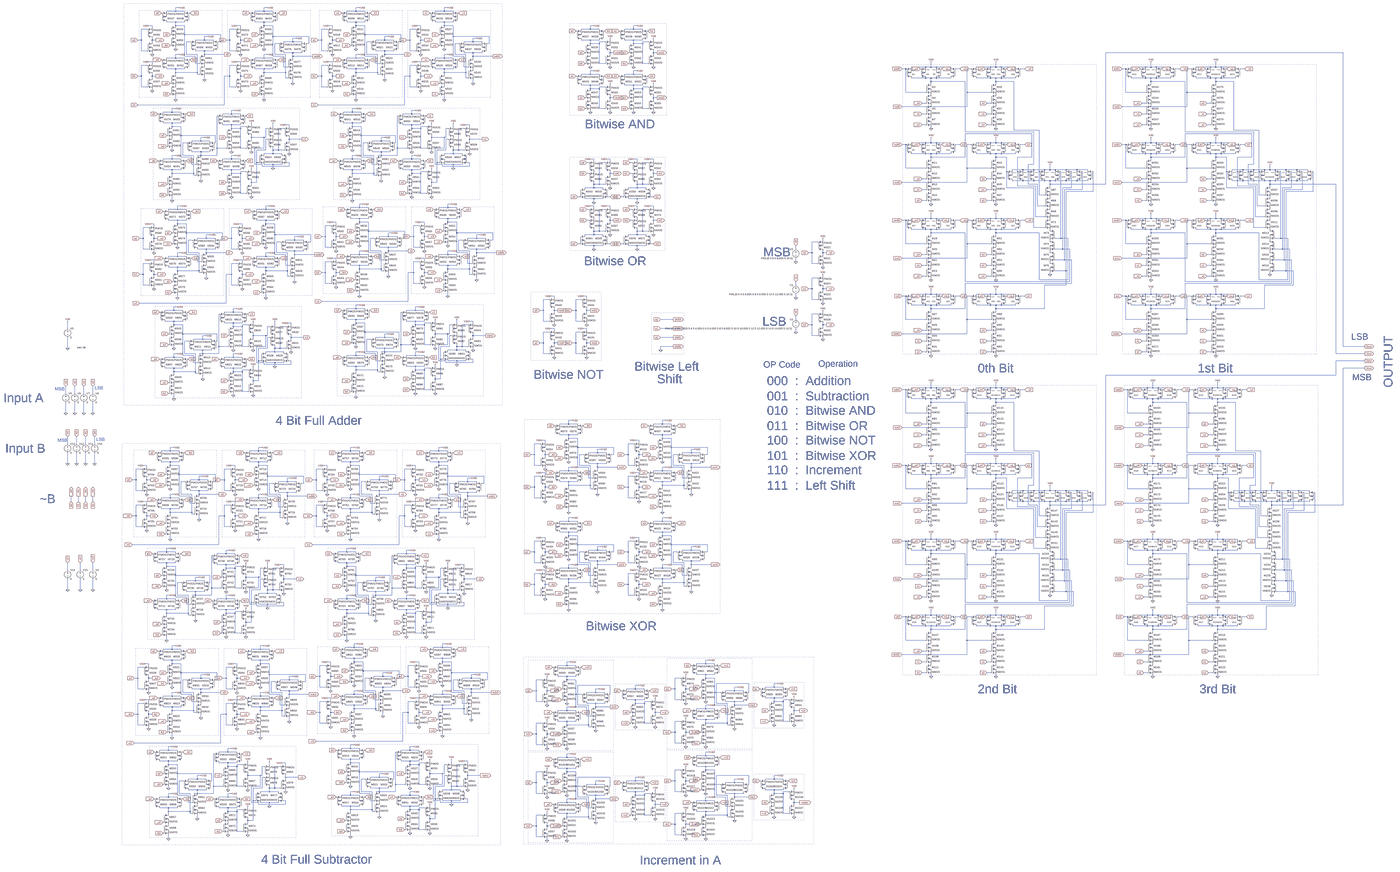
[diagram p0: schematic 4 bit ALU.asc, whole sheet]
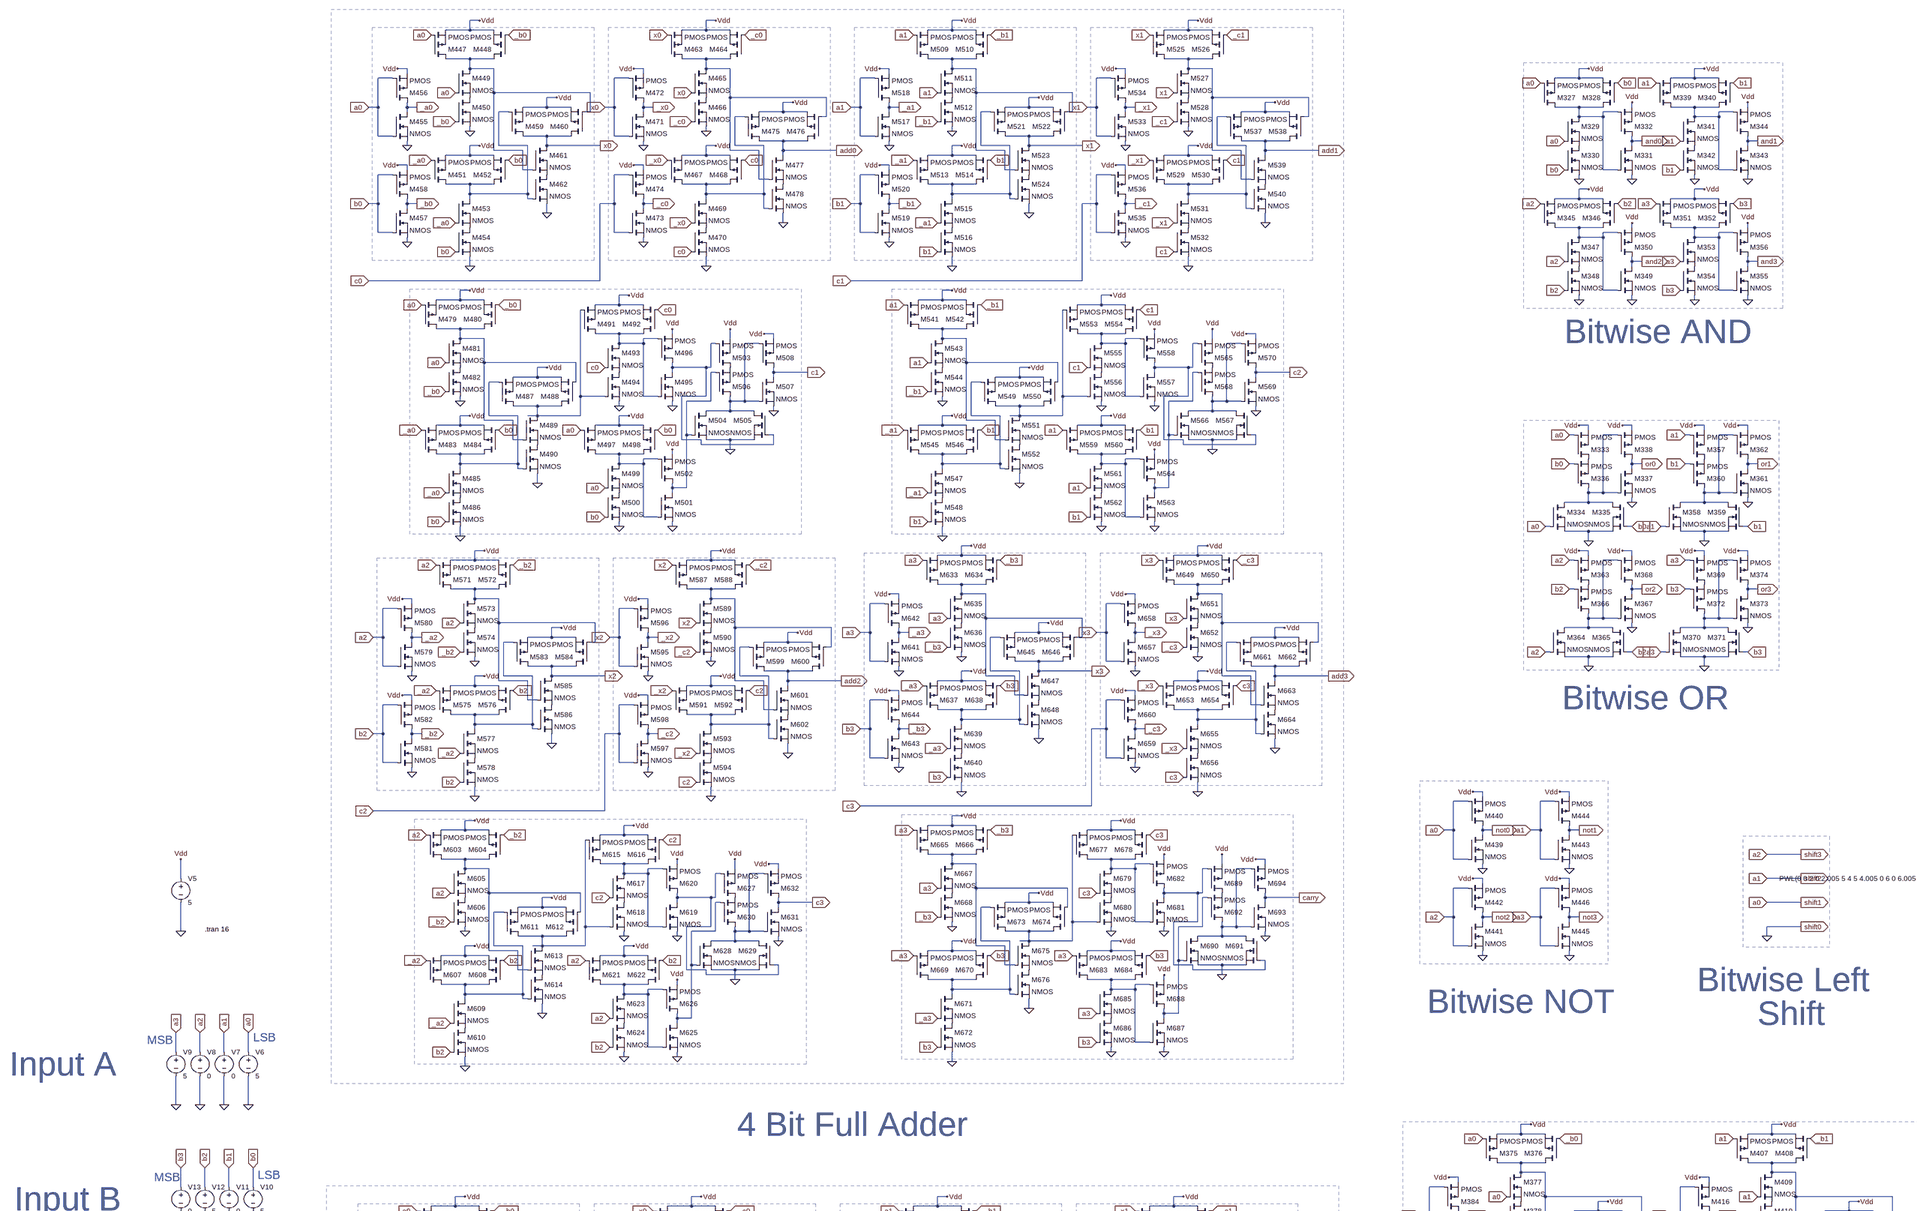
[diagram p1: schematic 4 bit ALU.asc, part, row 1 of 2, column 1 of 2]
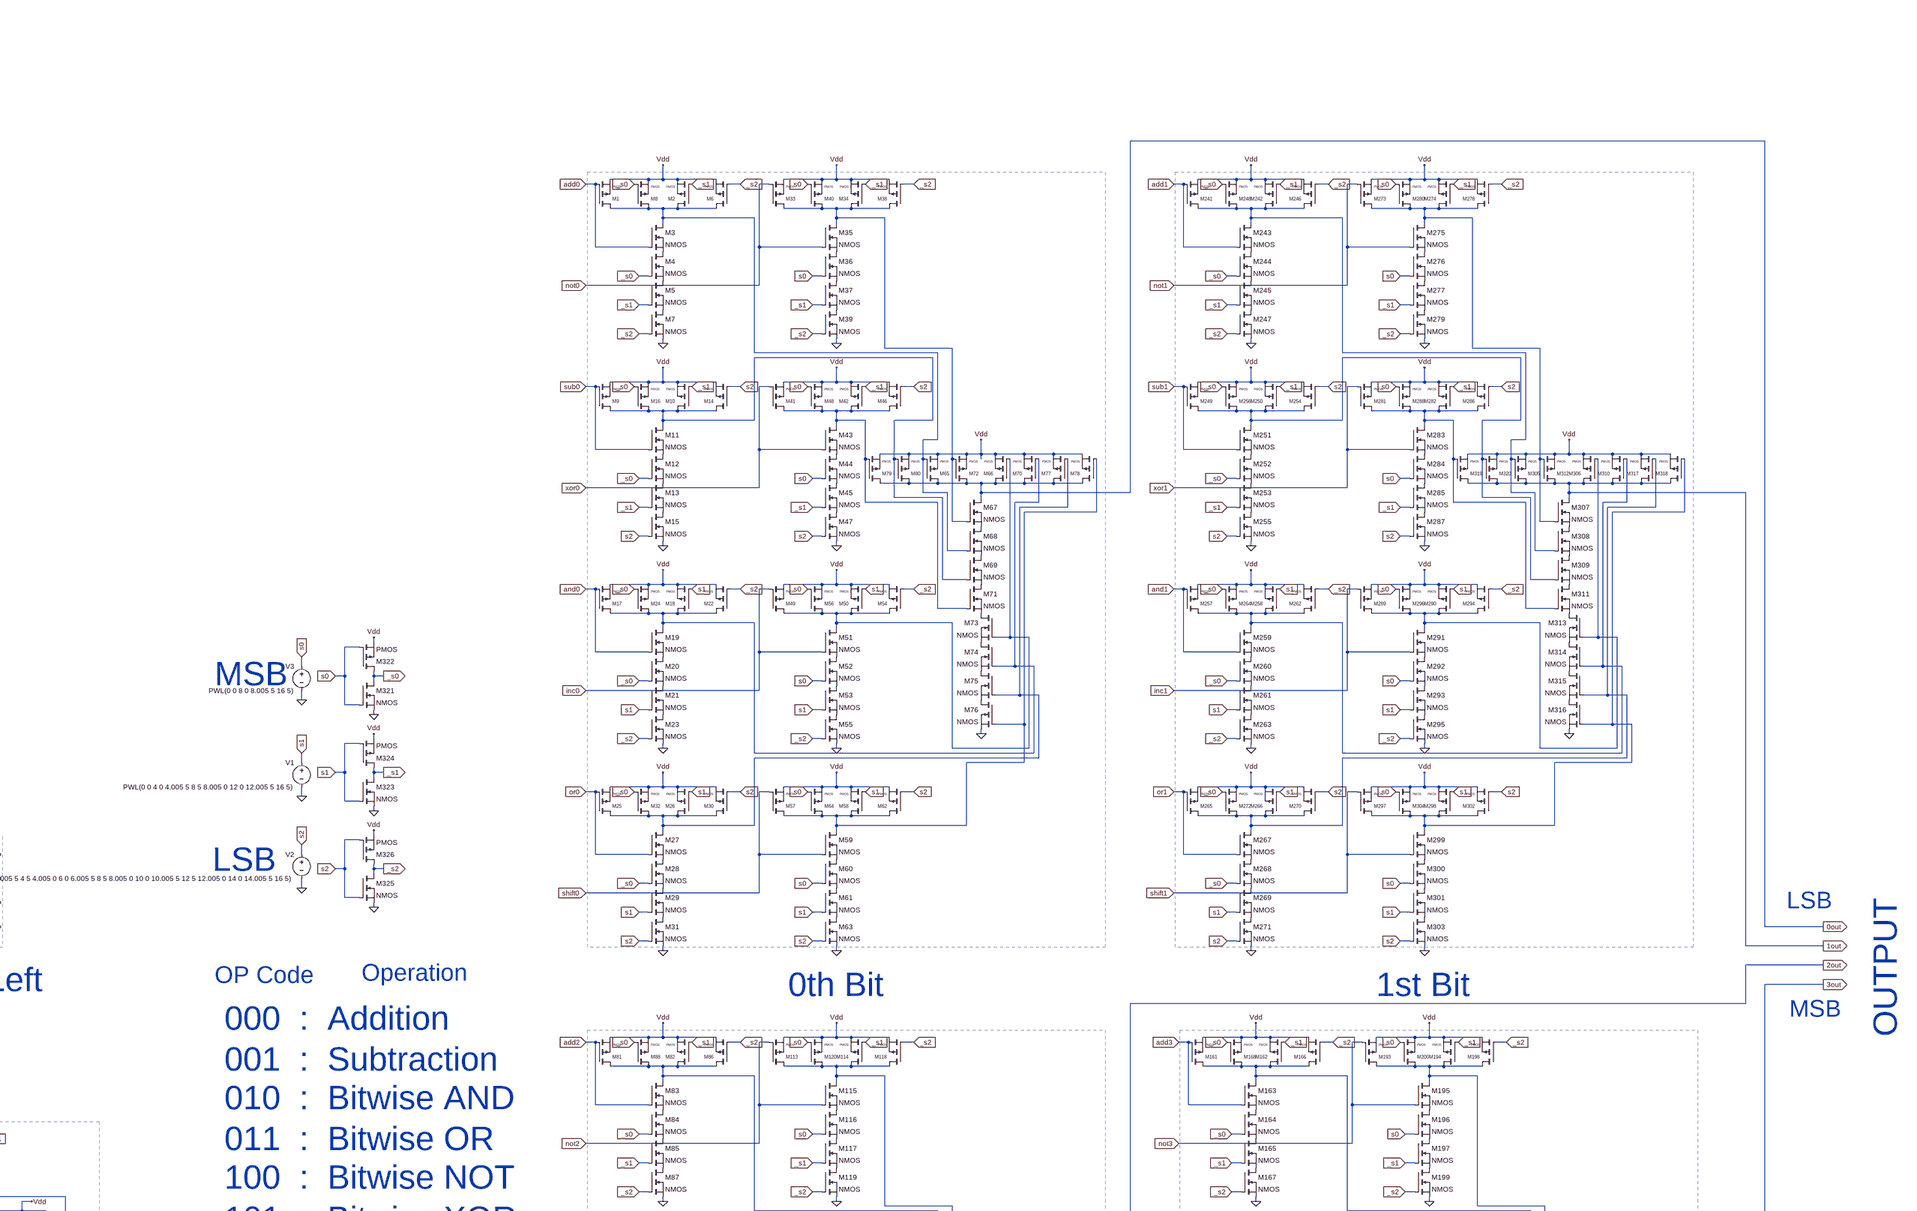
[diagram p2: schematic 4 bit ALU.asc, part, row 1 of 2, column 2 of 2]
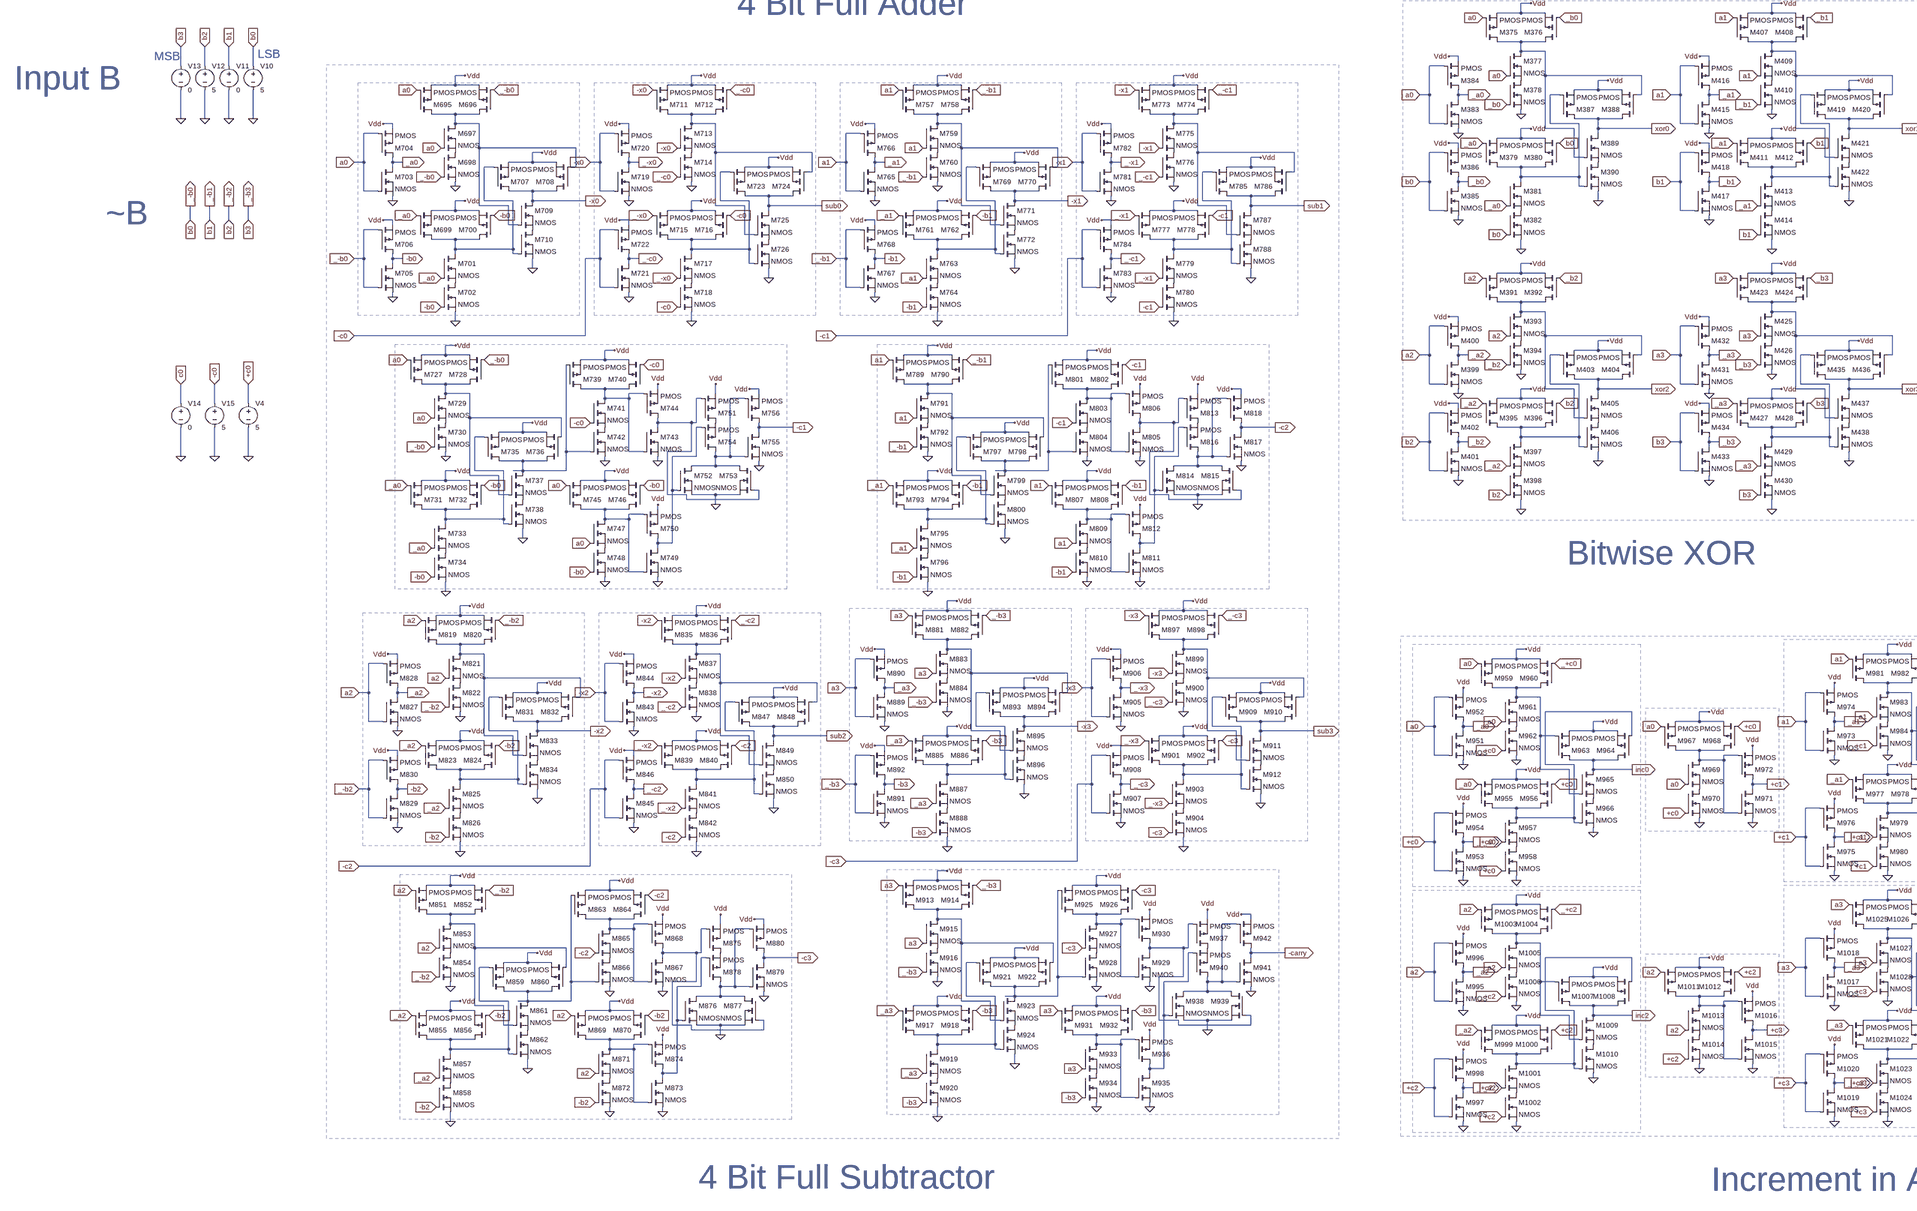
[diagram p3: schematic 4 bit ALU.asc, part, row 2 of 2, column 1 of 2]
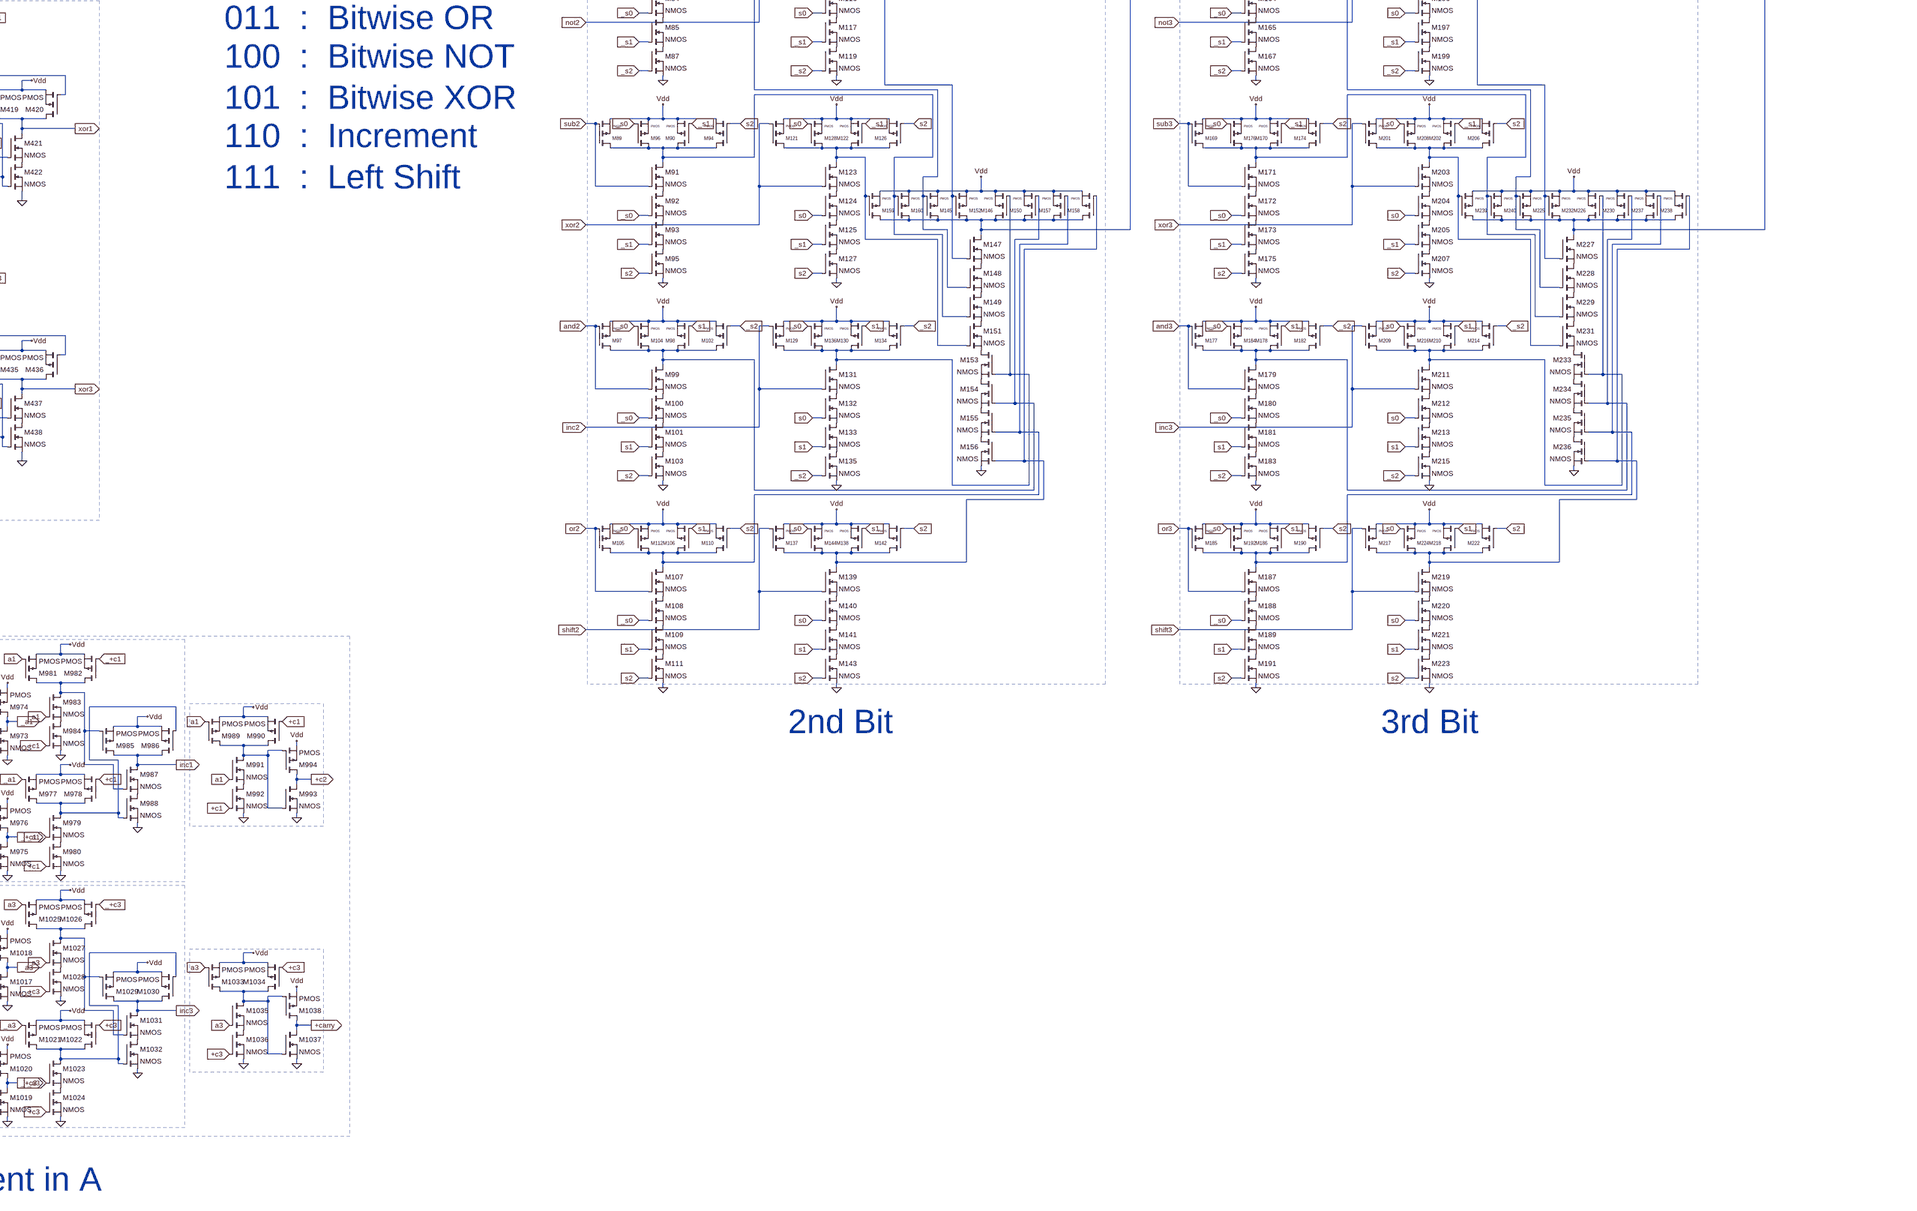
[diagram p4: schematic 4 bit ALU.asc, part, row 2 of 2, column 2 of 2]
* 4 bit ALU.asc
M1 N011 add0 Vdd Vdd PMOS
M2 N011 _s1 Vdd Vdd PMOS
M3 N011 add0 P001 P001 NMOS
M4 P001 _s0 P002 P002 NMOS
M5 P002 _s1 P003 P003 NMOS
M6 N011 _s2 Vdd Vdd PMOS
M7 P003 _s2 0 0 NMOS
M8 N011 _s0 Vdd Vdd PMOS
M9 N025 sub0 Vdd Vdd PMOS
M10 N025 _s1 Vdd Vdd PMOS
M11 N025 sub0 P004 P004 NMOS
M12 P004 _s0 P005 P005 NMOS
M13 P005 _s1 P006 P006 NMOS
M14 N025 s2 Vdd Vdd PMOS
M15 P006 s2 0 0 NMOS
M16 N025 _s0 Vdd Vdd PMOS
M17 N039 and0 Vdd Vdd PMOS
M18 N039 s1 Vdd Vdd PMOS
M19 N039 and0 P007 P007 NMOS
M20 P007 _s0 P008 P008 NMOS
M21 P008 s1 P009 P009 NMOS
M22 N039 _s2 Vdd Vdd PMOS
M23 P009 _s2 0 0 NMOS
M24 N039 _s0 Vdd Vdd PMOS
M25 N041 or0 Vdd Vdd PMOS
M26 N041 s1 Vdd Vdd PMOS
M27 N041 or0 P010 P010 NMOS
M28 P010 _s0 P011 P011 NMOS
M29 P011 s1 P012 P012 NMOS
M30 N041 s2 Vdd Vdd PMOS
M31 P012 s2 0 0 NMOS
M32 N041 _s0 Vdd Vdd PMOS
M33 N012 not0 Vdd Vdd PMOS
M34 N012 _s1 Vdd Vdd PMOS
M35 N012 not0 P013 P013 NMOS
M36 P013 s0 P014 P014 NMOS
M37 P014 _s1 P015 P015 NMOS
M38 N012 _s2 Vdd Vdd PMOS
M39 P015 _s2 0 0 NMOS
M40 N012 s0 Vdd Vdd PMOS
M41 N033 xor0 Vdd Vdd PMOS
M42 N033 _s1 Vdd Vdd PMOS
M43 N033 xor0 P016 P016 NMOS
M44 P016 s0 P017 P017 NMOS
M45 P017 _s1 P018 P018 NMOS
M46 N033 s2 Vdd Vdd PMOS
M47 P018 s2 0 0 NMOS
M48 N033 s0 Vdd Vdd PMOS
M49 N051 inc0 Vdd Vdd PMOS
M50 N051 s1 Vdd Vdd PMOS
M51 N051 inc0 P019 P019 NMOS
M52 P019 s0 P020 P020 NMOS
M53 P020 s1 P021 P021 NMOS
M54 N051 _s2 Vdd Vdd PMOS
M55 P021 _s2 0 0 NMOS
M56 N051 s0 Vdd Vdd PMOS
M57 N043 0 Vdd Vdd PMOS
M58 N043 s1 Vdd Vdd PMOS
M59 N043 0 P022 P022 NMOS
M60 P022 s0 P023 P023 NMOS
M61 P023 s1 P024 P024 NMOS
M62 N043 s2 Vdd Vdd PMOS
M63 P024 s2 0 0 NMOS
M64 N043 s0 Vdd Vdd PMOS
M65 0out N011 Vdd Vdd PMOS
M66 0out N051 Vdd Vdd PMOS
M67 0out N012 P025 P025 NMOS
M68 P025 N011 P026 P026 NMOS
M69 P026 N025 P027 P027 NMOS
M70 0out N039 Vdd Vdd PMOS
M71 P027 N033 P028 P028 NMOS
M72 0out N012 Vdd Vdd PMOS
M73 P028 N051 P029 P029 NMOS
M74 P029 N039 P030 P030 NMOS
M75 P030 N041 P031 P031 NMOS
M76 P031 N043 0 0 NMOS
M77 0out N041 Vdd Vdd PMOS
M78 0out N043 Vdd Vdd PMOS
M79 0out N033 Vdd Vdd PMOS
M80 0out N025 Vdd Vdd PMOS
M81 N073 add2 Vdd Vdd PMOS
M82 N073 _s1 Vdd Vdd PMOS
M83 N073 add2 P032 P032 NMOS
M84 P032 _s0 P033 P033 NMOS
M85 P033 _s1 P034 P034 NMOS
M86 N073 _s2 Vdd Vdd PMOS
M87 P034 _s2 0 0 NMOS
M88 N073 _s0 Vdd Vdd PMOS
M89 N081 sub2 Vdd Vdd PMOS
M90 N081 _s1 Vdd Vdd PMOS
M91 N081 sub2 P035 P035 NMOS
M92 P035 _s0 P036 P036 NMOS
M93 P036 _s1 P037 P037 NMOS
M94 N081 s2 Vdd Vdd PMOS
M95 P037 s2 0 0 NMOS
M96 N081 _s0 Vdd Vdd PMOS
M97 N093 and2 Vdd Vdd PMOS
M98 N093 s1 Vdd Vdd PMOS
M99 N093 and2 P038 P038 NMOS
M100 P038 _s0 P039 P039 NMOS
M101 P039 s1 P040 P040 NMOS
M102 N093 _s2 Vdd Vdd PMOS
M103 P040 _s2 0 0 NMOS
M104 N093 _s0 Vdd Vdd PMOS
M105 N095 or2 Vdd Vdd PMOS
M106 N095 s1 Vdd Vdd PMOS
M107 N095 or2 P041 P041 NMOS
M108 P041 _s0 P042 P042 NMOS
M109 P042 s1 P043 P043 NMOS
M110 N095 s2 Vdd Vdd PMOS
M111 P043 s2 0 0 NMOS
M112 N095 _s0 Vdd Vdd PMOS
M113 N074 not2 Vdd Vdd PMOS
M114 N074 _s1 Vdd Vdd PMOS
M115 N074 not2 P044 P044 NMOS
M116 P044 s0 P045 P045 NMOS
M117 P045 _s1 P046 P046 NMOS
M118 N074 _s2 Vdd Vdd PMOS
M119 P046 _s2 0 0 NMOS
M120 N074 s0 Vdd Vdd PMOS
M121 N087 xor2 Vdd Vdd PMOS
M122 N087 _s1 Vdd Vdd PMOS
M123 N087 xor2 P047 P047 NMOS
M124 P047 s0 P048 P048 NMOS
M125 P048 _s1 P049 P049 NMOS
M126 N087 s2 Vdd Vdd PMOS
M127 P049 s2 0 0 NMOS
M128 N087 s0 Vdd Vdd PMOS
M129 N101 inc2 Vdd Vdd PMOS
M130 N101 s1 Vdd Vdd PMOS
M131 N101 inc2 P050 P050 NMOS
M132 P050 s0 P051 P051 NMOS
M133 P051 s1 P052 P052 NMOS
M134 N101 _s2 Vdd Vdd PMOS
M135 P052 _s2 0 0 NMOS
M136 N101 s0 Vdd Vdd PMOS
M137 N097 a1 Vdd Vdd PMOS
M138 N097 s1 Vdd Vdd PMOS
M139 N097 a1 P053 P053 NMOS
M140 P053 s0 P054 P054 NMOS
M141 P054 s1 P055 P055 NMOS
M142 N097 s2 Vdd Vdd PMOS
M143 P055 s2 0 0 NMOS
M144 N097 s0 Vdd Vdd PMOS
M145 2out N073 Vdd Vdd PMOS
M146 2out N101 Vdd Vdd PMOS
M147 2out N074 P056 P056 NMOS
M148 P056 N073 P057 P057 NMOS
M149 P057 N081 P058 P058 NMOS
M150 2out N093 Vdd Vdd PMOS
M151 P058 N087 P059 P059 NMOS
M152 2out N074 Vdd Vdd PMOS
M153 P059 N101 P060 P060 NMOS
M154 P060 N093 P061 P061 NMOS
M155 P061 N095 P062 P062 NMOS
M156 P062 N097 0 0 NMOS
M157 2out N095 Vdd Vdd PMOS
M158 2out N097 Vdd Vdd PMOS
M159 2out N087 Vdd Vdd PMOS
M160 2out N081 Vdd Vdd PMOS
M161 N075 add3 Vdd Vdd PMOS
M162 N075 _s1 Vdd Vdd PMOS
M163 N075 add3 P063 P063 NMOS
M164 P063 _s0 P064 P064 NMOS
M165 P064 _s1 P065 P065 NMOS
M166 N075 _s2 Vdd Vdd PMOS
M167 P065 _s2 0 0 NMOS
M168 N075 _s0 Vdd Vdd PMOS
M169 N082 sub3 Vdd Vdd PMOS
M170 N082 _s1 Vdd Vdd PMOS
M171 N082 sub3 P066 P066 NMOS
M172 P066 _s0 P067 P067 NMOS
M173 P067 _s1 P068 P068 NMOS
M174 N082 s2 Vdd Vdd PMOS
M175 P068 s2 0 0 NMOS
M176 N082 _s0 Vdd Vdd PMOS
M177 N094 and3 Vdd Vdd PMOS
M178 N094 s1 Vdd Vdd PMOS
M179 N094 and3 P069 P069 NMOS
M180 P069 _s0 P070 P070 NMOS
M181 P070 s1 P071 P071 NMOS
M182 N094 _s2 Vdd Vdd PMOS
M183 P071 _s2 0 0 NMOS
M184 N094 _s0 Vdd Vdd PMOS
M185 N096 or3 Vdd Vdd PMOS
M186 N096 s1 Vdd Vdd PMOS
M187 N096 or3 P072 P072 NMOS
M188 P072 _s0 P073 P073 NMOS
M189 P073 s1 P074 P074 NMOS
M190 N096 s2 Vdd Vdd PMOS
M191 P074 s2 0 0 NMOS
M192 N096 _s0 Vdd Vdd PMOS
M193 N076 not3 Vdd Vdd PMOS
M194 N076 _s1 Vdd Vdd PMOS
M195 N076 not3 P075 P075 NMOS
M196 P075 s0 P076 P076 NMOS
M197 P076 _s1 P077 P077 NMOS
M198 N076 _s2 Vdd Vdd PMOS
M199 P077 _s2 0 0 NMOS
M200 N076 s0 Vdd Vdd PMOS
M201 N088 xor3 Vdd Vdd PMOS
M202 N088 _s1 Vdd Vdd PMOS
M203 N088 xor3 P078 P078 NMOS
M204 P078 s0 P079 P079 NMOS
M205 P079 _s1 P080 P080 NMOS
M206 N088 s2 Vdd Vdd PMOS
M207 P080 s2 0 0 NMOS
M208 N088 s0 Vdd Vdd PMOS
M209 N102 inc3 Vdd Vdd PMOS
M210 N102 s1 Vdd Vdd PMOS
M211 N102 inc3 P081 P081 NMOS
M212 P081 s0 P082 P082 NMOS
M213 P082 s1 P083 P083 NMOS
M214 N102 _s2 Vdd Vdd PMOS
M215 P083 _s2 0 0 NMOS
M216 N102 s0 Vdd Vdd PMOS
M217 N098 a2 Vdd Vdd PMOS
M218 N098 s1 Vdd Vdd PMOS
M219 N098 a2 P084 P084 NMOS
M220 P084 s0 P085 P085 NMOS
M221 P085 s1 P086 P086 NMOS
M222 N098 s2 Vdd Vdd PMOS
M223 P086 s2 0 0 NMOS
M224 N098 s0 Vdd Vdd PMOS
M225 3out N075 Vdd Vdd PMOS
M226 3out N102 Vdd Vdd PMOS
M227 3out N076 P087 P087 NMOS
M228 P087 N075 P088 P088 NMOS
M229 P088 N082 P089 P089 NMOS
M230 3out N094 Vdd Vdd PMOS
M231 P089 N088 P090 P090 NMOS
M232 3out N076 Vdd Vdd PMOS
M233 P090 N102 P091 P091 NMOS
M234 P091 N094 P092 P092 NMOS
M235 P092 N096 P093 P093 NMOS
M236 P093 N098 0 0 NMOS
M237 3out N096 Vdd Vdd PMOS
M238 3out N098 Vdd Vdd PMOS
M239 3out N088 Vdd Vdd PMOS
M240 3out N082 Vdd Vdd PMOS
M241 N013 add1 Vdd Vdd PMOS
M242 N013 _s1 Vdd Vdd PMOS
M243 N013 add1 P094 P094 NMOS
M244 P094 _s0 P095 P095 NMOS
M245 P095 _s1 P096 P096 NMOS
M246 N013 _s2 Vdd Vdd PMOS
M247 P096 _s2 0 0 NMOS
M248 N013 _s0 Vdd Vdd PMOS
M249 N026 sub1 Vdd Vdd PMOS
M250 N026 _s1 Vdd Vdd PMOS
M251 N026 sub1 P097 P097 NMOS
M252 P097 _s0 P098 P098 NMOS
M253 P098 _s1 P099 P099 NMOS
M254 N026 s2 Vdd Vdd PMOS
M255 P099 s2 0 0 NMOS
M256 N026 _s0 Vdd Vdd PMOS
M257 N040 and1 Vdd Vdd PMOS
M258 N040 s1 Vdd Vdd PMOS
M259 N040 and1 P100 P100 NMOS
M260 P100 _s0 P101 P101 NMOS
M261 P101 s1 P102 P102 NMOS
M262 N040 _s2 Vdd Vdd PMOS
M263 P102 _s2 0 0 NMOS
M264 N040 _s0 Vdd Vdd PMOS
M265 N042 or1 Vdd Vdd PMOS
M266 N042 s1 Vdd Vdd PMOS
M267 N042 or1 P103 P103 NMOS
M268 P103 _s0 P104 P104 NMOS
M269 P104 s1 P105 P105 NMOS
M270 N042 s2 Vdd Vdd PMOS
M271 P105 s2 0 0 NMOS
M272 N042 _s0 Vdd Vdd PMOS
M273 N014 not1 Vdd Vdd PMOS
M274 N014 _s1 Vdd Vdd PMOS
M275 N014 not1 P106 P106 NMOS
M276 P106 s0 P107 P107 NMOS
M277 P107 _s1 P108 P108 NMOS
M278 N014 _s2 Vdd Vdd PMOS
M279 P108 _s2 0 0 NMOS
M280 N014 s0 Vdd Vdd PMOS
M281 N034 xor1 Vdd Vdd PMOS
M282 N034 _s1 Vdd Vdd PMOS
M283 N034 xor1 P109 P109 NMOS
M284 P109 s0 P110 P110 NMOS
M285 P110 _s1 P111 P111 NMOS
M286 N034 s2 Vdd Vdd PMOS
M287 P111 s2 0 0 NMOS
M288 N034 s0 Vdd Vdd PMOS
M289 N052 inc1 Vdd Vdd PMOS
M290 N052 s1 Vdd Vdd PMOS
M291 N052 inc1 P112 P112 NMOS
M292 P112 s0 P113 P113 NMOS
M293 P113 s1 P114 P114 NMOS
M294 N052 _s2 Vdd Vdd PMOS
M295 P114 _s2 0 0 NMOS
M296 N052 s0 Vdd Vdd PMOS
M297 N044 a0 Vdd Vdd PMOS
M298 N044 s1 Vdd Vdd PMOS
M299 N044 a0 P115 P115 NMOS
M300 P115 s0 P116 P116 NMOS
M301 P116 s1 P117 P117 NMOS
M302 N044 s2 Vdd Vdd PMOS
M303 P117 s2 0 0 NMOS
M304 N044 s0 Vdd Vdd PMOS
M305 1out N013 Vdd Vdd PMOS
M306 1out N052 Vdd Vdd PMOS
M307 1out N014 P118 P118 NMOS
M308 P118 N013 P119 P119 NMOS
M309 P119 N026 P120 P120 NMOS
M310 1out N040 Vdd Vdd PMOS
M311 P120 N034 P121 P121 NMOS
M312 1out N014 Vdd Vdd PMOS
M313 P121 N052 P122 P122 NMOS
M314 P122 N040 P123 P123 NMOS
M315 P123 N042 P124 P124 NMOS
M316 P124 N044 0 0 NMOS
M317 1out N042 Vdd Vdd PMOS
M318 1out N044 Vdd Vdd PMOS
M319 1out N034 Vdd Vdd PMOS
M320 1out N026 Vdd Vdd PMOS
V1 s1 0 PWL(0 0 4 0 4.005 5 8 5 8.005 0 12 0 12.005 5 16 5)
M321 _s0 s0 0 0 NMOS
M322 _s0 s0 Vdd Vdd PMOS
V2 s2 0 PWL(0 0 2 0 2.005 5 4 5 4.005 0 6 0 6.005 5 8 5 8.005 0 10 0 10.005 5 12 5 12.005 0 14 0 14.005 5 16 5)
M323 _s1 s1 0 0 NMOS
M324 _s1 s1 Vdd Vdd PMOS
V3 s0 0 PWL(0 0 8 0 8.005 5 16 5)
M325 _s2 s2 0 0 NMOS
M326 _s2 s2 Vdd Vdd PMOS
M327 N005 a0 Vdd Vdd PMOS
M328 N005 _-b0 Vdd Vdd PMOS
M329 N005 a0 P125 P125 NMOS
M330 P125 _-b0 0 0 NMOS
M331 and0 N005 0 0 NMOS
M332 and0 N005 Vdd Vdd PMOS
M333 P126 a0 Vdd Vdd PMOS
M334 N035 a0 0 0 NMOS
M335 N035 _-b0 0 0 NMOS
M336 N035 _-b0 P126 P126 PMOS
M337 or0 N035 0 0 NMOS
M338 or0 N035 Vdd Vdd PMOS
M339 N006 a1 Vdd Vdd PMOS
M340 N006 _-b1 Vdd Vdd PMOS
M341 N006 a1 P127 P127 NMOS
M342 P127 _-b1 0 0 NMOS
M343 and1 N006 0 0 NMOS
M344 and1 N006 Vdd Vdd PMOS
M345 N015 a2 Vdd Vdd PMOS
M346 N015 _-b2 Vdd Vdd PMOS
M347 N015 a2 P128 P128 NMOS
M348 P128 _-b2 0 0 NMOS
M349 and2 N015 0 0 NMOS
M350 and2 N015 Vdd Vdd PMOS
M351 N016 a3 Vdd Vdd PMOS
M352 N016 _-b3 Vdd Vdd PMOS
M353 N016 a3 P129 P129 NMOS
M354 P129 _-b3 0 0 NMOS
M355 and3 N016 0 0 NMOS
M356 and3 N016 Vdd Vdd PMOS
M357 P130 a1 Vdd Vdd PMOS
M358 N036 a1 0 0 NMOS
M359 N036 _-b1 0 0 NMOS
M360 N036 _-b1 P130 P130 PMOS
M361 or1 N036 0 0 NMOS
M362 or1 N036 Vdd Vdd PMOS
M363 P131 a2 Vdd Vdd PMOS
M364 N045 a2 0 0 NMOS
M365 N045 _-b2 0 0 NMOS
M366 N045 _-b2 P131 P131 PMOS
M367 or2 N045 0 0 NMOS
M368 or2 N045 Vdd Vdd PMOS
M369 P132 a3 Vdd Vdd PMOS
M370 N046 a3 0 0 NMOS
M371 N046 _-b3 0 0 NMOS
M372 N046 _-b3 P132 P132 PMOS
M373 or3 N046 0 0 NMOS
M374 or3 N046 Vdd Vdd PMOS
M375 N077 a0 Vdd Vdd PMOS
M376 N077 _b0 Vdd Vdd PMOS
M377 N077 a0 P133 P133 NMOS
M378 P133 _b0 0 0 NMOS
M379 N079 _a0 Vdd Vdd PMOS
M380 N079 _-b0 Vdd Vdd PMOS
M381 N079 _a0 P134 P134 NMOS
M382 P134 _-b0 0 0 NMOS
M383 _a0 a0 0 0 NMOS
M384 _a0 a0 Vdd Vdd PMOS
M385 _b0 _-b0 0 0 NMOS
M386 _b0 _-b0 Vdd Vdd PMOS
M387 xor0 N079 Vdd Vdd PMOS
M388 xor0 N077 Vdd Vdd PMOS
M389 xor0 N077 P135 P135 NMOS
M390 P135 N079 0 0 NMOS
M391 N099 a2 Vdd Vdd PMOS
M392 N099 _b2 Vdd Vdd PMOS
M393 N099 a2 P136 P136 NMOS
M394 P136 _b2 0 0 NMOS
M395 N103 _a2 Vdd Vdd PMOS
M396 N103 _-b2 Vdd Vdd PMOS
M397 N103 _a2 P137 P137 NMOS
M398 P137 _-b2 0 0 NMOS
M399 _a2 a2 0 0 NMOS
M400 _a2 a2 Vdd Vdd PMOS
M401 _b2 _-b2 0 0 NMOS
M402 _b2 _-b2 Vdd Vdd PMOS
M403 xor2 N103 Vdd Vdd PMOS
M404 xor2 N099 Vdd Vdd PMOS
M405 xor2 N099 P138 P138 NMOS
M406 P138 N103 0 0 NMOS
M407 N078 a1 Vdd Vdd PMOS
M408 N078 _b1 Vdd Vdd PMOS
M409 N078 a1 P139 P139 NMOS
M410 P139 _b1 0 0 NMOS
M411 N080 _a1 Vdd Vdd PMOS
M412 N080 _-b1 Vdd Vdd PMOS
M413 N080 _a1 P140 P140 NMOS
M414 P140 _-b1 0 0 NMOS
M415 _a1 a1 0 0 NMOS
M416 _a1 a1 Vdd Vdd PMOS
M417 _b1 _-b1 0 0 NMOS
M418 _b1 _-b1 Vdd Vdd PMOS
M419 xor1 N080 Vdd Vdd PMOS
M420 xor1 N078 Vdd Vdd PMOS
M421 xor1 N078 P141 P141 NMOS
M422 P141 N080 0 0 NMOS
M423 N100 a3 Vdd Vdd PMOS
M424 N100 _b3 Vdd Vdd PMOS
M425 N100 a3 P142 P142 NMOS
M426 P142 _b3 0 0 NMOS
M427 N104 _a3 Vdd Vdd PMOS
M428 N104 _-b3 Vdd Vdd PMOS
M429 N104 _a3 P143 P143 NMOS
M430 P143 _-b3 0 0 NMOS
M431 _a3 a3 0 0 NMOS
M432 _a3 a3 Vdd Vdd PMOS
M433 _b3 _-b3 0 0 NMOS
M434 _b3 _-b3 Vdd Vdd PMOS
M435 xor3 N104 Vdd Vdd PMOS
M436 xor3 N100 Vdd Vdd PMOS
M437 xor3 N100 P144 P144 NMOS
M438 P144 N104 0 0 NMOS
M439 not0 a0 0 0 NMOS
M440 not0 a0 Vdd Vdd PMOS
M441 not2 a2 0 0 NMOS
M442 not2 a2 Vdd Vdd PMOS
M443 not1 a1 0 0 NMOS
M444 not1 a1 Vdd Vdd PMOS
M445 not3 a3 0 0 NMOS
M446 not3 a3 Vdd Vdd PMOS
M447 N001 a0 Vdd Vdd PMOS
M448 N001 _b0 Vdd Vdd PMOS
M449 N001 a0 P145 P145 NMOS
M450 P145 _b0 0 0 NMOS
M451 N007 _a0 Vdd Vdd PMOS
M452 N007 _-b0 Vdd Vdd PMOS
M453 N007 _a0 P146 P146 NMOS
M454 P146 _-b0 0 0 NMOS
M455 _a0 a0 0 0 NMOS
M456 _a0 a0 Vdd Vdd PMOS
M457 _b0 _-b0 0 0 NMOS
M458 _b0 _-b0 Vdd Vdd PMOS
M459 x0 N007 Vdd Vdd PMOS
M460 x0 N001 Vdd Vdd PMOS
M461 x0 N001 P147 P147 NMOS
M462 P147 N007 0 0 NMOS
M463 N002 x0 Vdd Vdd PMOS
M464 N002 _c0 Vdd Vdd PMOS
M465 N002 x0 P148 P148 NMOS
M466 P148 _c0 0 0 NMOS
M467 N009 _x0 Vdd Vdd PMOS
M468 N009 c0 Vdd Vdd PMOS
M469 N009 _x0 P149 P149 NMOS
M470 P149 c0 0 0 NMOS
M471 _x0 x0 0 0 NMOS
M472 _x0 x0 Vdd Vdd PMOS
M473 _c0 c0 0 0 NMOS
M474 _c0 c0 Vdd Vdd PMOS
M475 add0 N009 Vdd Vdd PMOS
M476 add0 N002 Vdd Vdd PMOS
M477 add0 N002 P150 P150 NMOS
M478 P150 N009 0 0 NMOS
M479 N017 a0 Vdd Vdd PMOS
M480 N017 _b0 Vdd Vdd PMOS
M481 N017 a0 P151 P151 NMOS
M482 P151 _b0 0 0 NMOS
M483 N029 _a0 Vdd Vdd PMOS
M484 N029 _-b0 Vdd Vdd PMOS
M485 N029 _a0 P152 P152 NMOS
M486 P152 _-b0 0 0 NMOS
M487 N031 N029 Vdd Vdd PMOS
M488 N031 N017 Vdd Vdd PMOS
M489 N031 N017 P153 P153 NMOS
M490 P153 N029 0 0 NMOS
M491 N019 N031 Vdd Vdd PMOS
M492 N019 c0 Vdd Vdd PMOS
M493 N019 c0 P154 P154 NMOS
M494 P154 N031 0 0 NMOS
M495 N021 N019 0 0 NMOS
M496 N021 N019 Vdd Vdd PMOS
M497 N037 a0 Vdd Vdd PMOS
M498 N037 _-b0 Vdd Vdd PMOS
M499 N037 a0 P155 P155 NMOS
M500 P155 _-b0 0 0 NMOS
M501 N027 N037 0 0 NMOS
M502 N027 N037 Vdd Vdd PMOS
M503 P156 N021 Vdd Vdd PMOS
M504 N022 N027 0 0 NMOS
M505 N022 N021 0 0 NMOS
M506 N022 N027 P156 P156 PMOS
M507 c1 N022 0 0 NMOS
M508 c1 N022 Vdd Vdd PMOS
M509 N003 a1 Vdd Vdd PMOS
M510 N003 _b1 Vdd Vdd PMOS
M511 N003 a1 P157 P157 NMOS
M512 P157 _b1 0 0 NMOS
M513 N008 _a1 Vdd Vdd PMOS
M514 N008 _-b1 Vdd Vdd PMOS
M515 N008 _a1 P158 P158 NMOS
M516 P158 _-b1 0 0 NMOS
M517 _a1 a1 0 0 NMOS
M518 _a1 a1 Vdd Vdd PMOS
M519 _b1 _-b1 0 0 NMOS
M520 _b1 _-b1 Vdd Vdd PMOS
M521 x1 N008 Vdd Vdd PMOS
M522 x1 N003 Vdd Vdd PMOS
M523 x1 N003 P159 P159 NMOS
M524 P159 N008 0 0 NMOS
M525 N004 x1 Vdd Vdd PMOS
M526 N004 _c1 Vdd Vdd PMOS
M527 N004 x1 P160 P160 NMOS
M528 P160 _c1 0 0 NMOS
M529 N010 _x1 Vdd Vdd PMOS
M530 N010 c1 Vdd Vdd PMOS
M531 N010 _x1 P161 P161 NMOS
M532 P161 c1 0 0 NMOS
M533 _x1 x1 0 0 NMOS
M534 _x1 x1 Vdd Vdd PMOS
M535 _c1 c1 0 0 NMOS
M536 _c1 c1 Vdd Vdd PMOS
M537 add1 N010 Vdd Vdd PMOS
M538 add1 N004 Vdd Vdd PMOS
M539 add1 N004 P162 P162 NMOS
M540 P162 N010 0 0 NMOS
M541 N018 a1 Vdd Vdd PMOS
M542 N018 _b1 Vdd Vdd PMOS
M543 N018 a1 P163 P163 NMOS
M544 P163 _b1 0 0 NMOS
M545 N030 _a1 Vdd Vdd PMOS
M546 N030 _-b1 Vdd Vdd PMOS
M547 N030 _a1 P164 P164 NMOS
M548 P164 _-b1 0 0 NMOS
M549 N032 N030 Vdd Vdd PMOS
M550 N032 N018 Vdd Vdd PMOS
M551 N032 N018 P165 P165 NMOS
M552 P165 N030 0 0 NMOS
M553 N020 N032 Vdd Vdd PMOS
M554 N020 c1 Vdd Vdd PMOS
M555 N020 c1 P166 P166 NMOS
M556 P166 N032 0 0 NMOS
M557 N023 N020 0 0 NMOS
M558 N023 N020 Vdd Vdd PMOS
M559 N038 a1 Vdd Vdd PMOS
M560 N038 _-b1 Vdd Vdd PMOS
M561 N038 a1 P167 P167 NMOS
M562 P167 _-b1 0 0 NMOS
M563 N028 N038 0 0 NMOS
M564 N028 N038 Vdd Vdd PMOS
M565 P168 N023 Vdd Vdd PMOS
M566 N024 N028 0 0 NMOS
M567 N024 N023 0 0 NMOS
M568 N024 N028 P168 P168 PMOS
M569 c2 N024 0 0 NMOS
M570 c2 N024 Vdd Vdd PMOS
M571 N049 a2 Vdd Vdd PMOS
M572 N049 _b2 Vdd Vdd PMOS
M573 N049 a2 P169 P169 NMOS
M574 P169 _b2 0 0 NMOS
M575 N054 _a2 Vdd Vdd PMOS
M576 N054 _-b2 Vdd Vdd PMOS
M577 N054 _a2 P170 P170 NMOS
M578 P170 _-b2 0 0 NMOS
M579 _a2 a2 0 0 NMOS
M580 _a2 a2 Vdd Vdd PMOS
M581 _b2 _-b2 0 0 NMOS
M582 _b2 _-b2 Vdd Vdd PMOS
M583 x2 N054 Vdd Vdd PMOS
M584 x2 N049 Vdd Vdd PMOS
M585 x2 N049 P171 P171 NMOS
M586 P171 N054 0 0 NMOS
M587 N050 x2 Vdd Vdd PMOS
M588 N050 _c2 Vdd Vdd PMOS
M589 N050 x2 P172 P172 NMOS
M590 P172 _c2 0 0 NMOS
M591 N056 _x2 Vdd Vdd PMOS
M592 N056 c2 Vdd Vdd PMOS
M593 N056 _x2 P173 P173 NMOS
M594 P173 c2 0 0 NMOS
M595 _x2 x2 0 0 NMOS
M596 _x2 x2 Vdd Vdd PMOS
M597 _c2 c2 0 0 NMOS
M598 _c2 c2 Vdd Vdd PMOS
M599 add2 N056 Vdd Vdd PMOS
M600 add2 N050 Vdd Vdd PMOS
M601 add2 N050 P174 P174 NMOS
M602 P174 N056 0 0 NMOS
M603 N058 a2 Vdd Vdd PMOS
M604 N058 _b2 Vdd Vdd PMOS
M605 N058 a2 P175 P175 NMOS
M606 P175 _b2 0 0 NMOS
M607 N068 _a2 Vdd Vdd PMOS
M608 N068 _-b2 Vdd Vdd PMOS
M609 N068 _a2 P176 P176 NMOS
M610 P176 _-b2 0 0 NMOS
M611 N070 N068 Vdd Vdd PMOS
M612 N070 N058 Vdd Vdd PMOS
M613 N070 N058 P177 P177 NMOS
M614 P177 N068 0 0 NMOS
M615 N060 N070 Vdd Vdd PMOS
M616 N060 c2 Vdd Vdd PMOS
M617 N060 c2 P178 P178 NMOS
M618 P178 N070 0 0 NMOS
M619 N063 N060 0 0 NMOS
M620 N063 N060 Vdd Vdd PMOS
M621 N072 a2 Vdd Vdd PMOS
M622 N072 _-b2 Vdd Vdd PMOS
M623 N072 a2 P179 P179 NMOS
M624 P179 _-b2 0 0 NMOS
M625 N066 N072 0 0 NMOS
M626 N066 N072 Vdd Vdd PMOS
M627 P180 N063 Vdd Vdd PMOS
M628 N064 N066 0 0 NMOS
M629 N064 N063 0 0 NMOS
M630 N064 N066 P180 P180 PMOS
M631 c3 N064 0 0 NMOS
M632 c3 N064 Vdd Vdd PMOS
M633 N047 a3 Vdd Vdd PMOS
M634 N047 _b3 Vdd Vdd PMOS
M635 N047 a3 P181 P181 NMOS
M636 P181 _b3 0 0 NMOS
M637 N053 _a3 Vdd Vdd PMOS
M638 N053 _-b3 Vdd Vdd PMOS
M639 N053 _a3 P182 P182 NMOS
M640 P182 _-b3 0 0 NMOS
M641 _a3 a3 0 0 NMOS
M642 _a3 a3 Vdd Vdd PMOS
M643 _b3 _-b3 0 0 NMOS
M644 _b3 _-b3 Vdd Vdd PMOS
M645 x3 N053 Vdd Vdd PMOS
M646 x3 N047 Vdd Vdd PMOS
M647 x3 N047 P183 P183 NMOS
M648 P183 N053 0 0 NMOS
M649 N048 x3 Vdd Vdd PMOS
M650 N048 _c3 Vdd Vdd PMOS
M651 N048 x3 P184 P184 NMOS
M652 P184 _c3 0 0 NMOS
M653 N055 _x3 Vdd Vdd PMOS
M654 N055 c3 Vdd Vdd PMOS
M655 N055 _x3 P185 P185 NMOS
M656 P185 c3 0 0 NMOS
M657 _x3 x3 0 0 NMOS
M658 _x3 x3 Vdd Vdd PMOS
M659 _c3 c3 0 0 NMOS
M660 _c3 c3 Vdd Vdd PMOS
M661 add3 N055 Vdd Vdd PMOS
M662 add3 N048 Vdd Vdd PMOS
M663 add3 N048 P186 P186 NMOS
M664 P186 N055 0 0 NMOS
M665 N057 a3 Vdd Vdd PMOS
M666 N057 _b3 Vdd Vdd PMOS
M667 N057 a3 P187 P187 NMOS
M668 P187 _b3 0 0 NMOS
M669 N067 _a3 Vdd Vdd PMOS
M670 N067 _-b3 Vdd Vdd PMOS
M671 N067 _a3 P188 P188 NMOS
M672 P188 _-b3 0 0 NMOS
M673 N069 N067 Vdd Vdd PMOS
M674 N069 N057 Vdd Vdd PMOS
M675 N069 N057 P189 P189 NMOS
M676 P189 N067 0 0 NMOS
M677 N059 N069 Vdd Vdd PMOS
M678 N059 c3 Vdd Vdd PMOS
M679 N059 c3 P190 P190 NMOS
M680 P190 N069 0 0 NMOS
M681 N061 N059 0 0 NMOS
M682 N061 N059 Vdd Vdd PMOS
M683 N071 a3 Vdd Vdd PMOS
M684 N071 _-b3 Vdd Vdd PMOS
M685 N071 a3 P191 P191 NMOS
M686 P191 _-b3 0 0 NMOS
M687 N065 N071 0 0 NMOS
M688 N065 N071 Vdd Vdd PMOS
M689 P192 N061 Vdd Vdd PMOS
M690 N062 N065 0 0 NMOS
M691 N062 N061 0 0 NMOS
M692 N062 N065 P192 P192 PMOS
M693 carry N062 0 0 NMOS
M694 carry N062 Vdd Vdd PMOS
V5 Vdd 0 5
V6 a0 0 5
V7 a1 0 0
V8 a2 0 0
V9 a3 0 5
V10 _-b0 0 5
V11 _-b1 0 0
V12 _-b2 0 5
V13 _-b3 0 0
V14 c0 0 0
V15 -c0 0 5
M951 _a0 a0 0 0 NMOS
M952 _a0 a0 Vdd Vdd PMOS
M953 _+c0 +c0 0 0 NMOS
M954 _+c0 +c0 Vdd Vdd PMOS
M955 N132 _a0 Vdd Vdd PMOS
M956 N132 +c0 Vdd Vdd PMOS
M957 N132 _a0 P193 P193 NMOS
M958 P193 +c0 0 0 NMOS
M959 N126 a0 Vdd Vdd PMOS
M960 N126 _+c0 Vdd Vdd PMOS
M961 N126 a0 P194 P194 NMOS
M962 P194 _+c0 0 0 NMOS
M963 inc0 N126 Vdd Vdd PMOS
M964 inc0 N132 Vdd Vdd PMOS
M965 inc0 N126 P195 P195 NMOS
M966 P195 N132 0 0 NMOS
M967 N134 a0 Vdd Vdd PMOS
M968 N134 +c0 Vdd Vdd PMOS
M969 N134 a0 P196 P196 NMOS
M970 P196 +c0 0 0 NMOS
M971 +c1 N134 0 0 NMOS
M972 +c1 N134 Vdd Vdd PMOS
M973 _a1 a1 0 0 NMOS
M974 _a1 a1 Vdd Vdd PMOS
M975 _+c1 +c1 0 0 NMOS
M976 _+c1 +c1 Vdd Vdd PMOS
M977 N131 _a1 Vdd Vdd PMOS
M978 N131 +c1 Vdd Vdd PMOS
M979 N131 _a1 P197 P197 NMOS
M980 P197 +c1 0 0 NMOS
M981 N125 a1 Vdd Vdd PMOS
M982 N125 _+c1 Vdd Vdd PMOS
M983 N125 a1 P198 P198 NMOS
M984 P198 _+c1 0 0 NMOS
M985 inc1 N125 Vdd Vdd PMOS
M986 inc1 N131 Vdd Vdd PMOS
M987 inc1 N125 P199 P199 NMOS
M988 P199 N131 0 0 NMOS
M989 N133 a1 Vdd Vdd PMOS
M990 N133 +c1 Vdd Vdd PMOS
M991 N133 a1 P200 P200 NMOS
M992 P200 +c1 0 0 NMOS
M993 +c2 N133 0 0 NMOS
M994 +c2 N133 Vdd Vdd PMOS
M995 _a2 a2 0 0 NMOS
M996 _a2 a2 Vdd Vdd PMOS
M997 _+c2 +c2 0 0 NMOS
M998 _+c2 +c2 Vdd Vdd PMOS
M999 N148 _a2 Vdd Vdd PMOS
M1000 N148 +c2 Vdd Vdd PMOS
M1001 N148 _a2 P201 P201 NMOS
M1002 P201 +c2 0 0 NMOS
M1003 N144 a2 Vdd Vdd PMOS
M1004 N144 _+c2 Vdd Vdd PMOS
M1005 N144 a2 P202 P202 NMOS
M1006 P202 _+c2 0 0 NMOS
M1007 inc2 N144 Vdd Vdd PMOS
M1008 inc2 N148 Vdd Vdd PMOS
M1009 inc2 N144 P203 P203 NMOS
M1010 P203 N148 0 0 NMOS
M1011 N154 a2 Vdd Vdd PMOS
M1012 N154 +c2 Vdd Vdd PMOS
M1013 N154 a2 P204 P204 NMOS
M1014 P204 +c2 0 0 NMOS
M1015 +c3 N154 0 0 NMOS
M1016 +c3 N154 Vdd Vdd PMOS
M1017 _a3 a3 0 0 NMOS
M1018 _a3 a3 Vdd Vdd PMOS
M1019 _+c3 +c3 0 0 NMOS
M1020 _+c3 +c3 Vdd Vdd PMOS
M1021 N146 _a3 Vdd Vdd PMOS
M1022 N146 +c3 Vdd Vdd PMOS
M1023 N146 _a3 P205 P205 NMOS
M1024 P205 +c3 0 0 NMOS
M1025 N143 a3 Vdd Vdd PMOS
M1026 N143 _+c3 Vdd Vdd PMOS
M1027 N143 a3 P206 P206 NMOS
M1028 P206 _+c3 0 0 NMOS
M1029 inc3 N143 Vdd Vdd PMOS
M1030 inc3 N146 Vdd Vdd PMOS
M1031 inc3 N143 P207 P207 NMOS
M1032 P207 N146 0 0 NMOS
M1033 N153 a3 Vdd Vdd PMOS
M1034 N153 +c3 Vdd Vdd PMOS
M1035 N153 a3 P208 P208 NMOS
M1036 P208 +c3 0 0 NMOS
M1037 +carry N153 0 0 NMOS
M1038 +carry N153 Vdd Vdd PMOS
V4 +c0 0 5
M695 N083 a0 Vdd Vdd PMOS
M696 N083 _-b0 Vdd Vdd PMOS
M697 N083 a0 P209 P209 NMOS
M698 P209 _-b0 0 0 NMOS
M699 N089 _a0 Vdd Vdd PMOS
M700 N089 -b0 Vdd Vdd PMOS
M701 N089 _a0 P210 P210 NMOS
M702 P210 -b0 0 0 NMOS
M703 _a0 a0 0 0 NMOS
M704 _a0 a0 Vdd Vdd PMOS
M705 -b0 _-b0 0 0 NMOS
M706 -b0 _-b0 Vdd Vdd PMOS
M707 -x0 N089 Vdd Vdd PMOS
M708 -x0 N083 Vdd Vdd PMOS
M709 -x0 N083 P211 P211 NMOS
M710 P211 N089 0 0 NMOS
M711 N084 -x0 Vdd Vdd PMOS
M712 N084 _-c0 Vdd Vdd PMOS
M713 N084 -x0 P212 P212 NMOS
M714 P212 _-c0 0 0 NMOS
M715 N091 _-x0 Vdd Vdd PMOS
M716 N091 -c0 Vdd Vdd PMOS
M717 N091 _-x0 P213 P213 NMOS
M718 P213 -c0 0 0 NMOS
M719 _-x0 -x0 0 0 NMOS
M720 _-x0 -x0 Vdd Vdd PMOS
M721 _-c0 -c0 0 0 NMOS
M722 _-c0 -c0 Vdd Vdd PMOS
M723 sub0 N091 Vdd Vdd PMOS
M724 sub0 N084 Vdd Vdd PMOS
M725 sub0 N084 P214 P214 NMOS
M726 P214 N091 0 0 NMOS
M727 N105 a0 Vdd Vdd PMOS
M728 N105 _-b0 Vdd Vdd PMOS
M729 N105 a0 P215 P215 NMOS
M730 P215 _-b0 0 0 NMOS
M731 N115 _a0 Vdd Vdd PMOS
M732 N115 -b0 Vdd Vdd PMOS
M733 N115 _a0 P216 P216 NMOS
M734 P216 -b0 0 0 NMOS
M735 N117 N115 Vdd Vdd PMOS
M736 N117 N105 Vdd Vdd PMOS
M737 N117 N105 P217 P217 NMOS
M738 P217 N115 0 0 NMOS
M739 N107 N117 Vdd Vdd PMOS
M740 N107 -c0 Vdd Vdd PMOS
M741 N107 -c0 P218 P218 NMOS
M742 P218 N117 0 0 NMOS
M743 N109 N107 0 0 NMOS
M744 N109 N107 Vdd Vdd PMOS
M745 N119 a0 Vdd Vdd PMOS
M746 N119 -b0 Vdd Vdd PMOS
M747 N119 a0 P219 P219 NMOS
M748 P219 -b0 0 0 NMOS
M749 N113 N119 0 0 NMOS
M750 N113 N119 Vdd Vdd PMOS
M751 P220 N109 Vdd Vdd PMOS
M752 N110 N113 0 0 NMOS
M753 N110 N109 0 0 NMOS
M754 N110 N113 P220 P220 PMOS
M755 -c1 N110 0 0 NMOS
M756 -c1 N110 Vdd Vdd PMOS
M757 N085 a1 Vdd Vdd PMOS
M758 N085 _-b1 Vdd Vdd PMOS
M759 N085 a1 P221 P221 NMOS
M760 P221 _-b1 0 0 NMOS
M761 N090 _a1 Vdd Vdd PMOS
M762 N090 -b1 Vdd Vdd PMOS
M763 N090 _a1 P222 P222 NMOS
M764 P222 -b1 0 0 NMOS
M765 _a1 a1 0 0 NMOS
M766 _a1 a1 Vdd Vdd PMOS
M767 -b1 _-b1 0 0 NMOS
M768 -b1 _-b1 Vdd Vdd PMOS
M769 -x1 N090 Vdd Vdd PMOS
M770 -x1 N085 Vdd Vdd PMOS
M771 -x1 N085 P223 P223 NMOS
M772 P223 N090 0 0 NMOS
M773 N086 -x1 Vdd Vdd PMOS
M774 N086 _-c1 Vdd Vdd PMOS
M775 N086 -x1 P224 P224 NMOS
M776 P224 _-c1 0 0 NMOS
M777 N092 _-x1 Vdd Vdd PMOS
M778 N092 -c1 Vdd Vdd PMOS
M779 N092 _-x1 P225 P225 NMOS
M780 P225 -c1 0 0 NMOS
M781 _-x1 -x1 0 0 NMOS
M782 _-x1 -x1 Vdd Vdd PMOS
M783 _-c1 -c1 0 0 NMOS
M784 _-c1 -c1 Vdd Vdd PMOS
M785 sub1 N092 Vdd Vdd PMOS
M786 sub1 N086 Vdd Vdd PMOS
M787 sub1 N086 P226 P226 NMOS
M788 P226 N092 0 0 NMOS
M789 N106 a1 Vdd Vdd PMOS
M790 N106 _-b1 Vdd Vdd PMOS
M791 N106 a1 P227 P227 NMOS
M792 P227 _-b1 0 0 NMOS
M793 N116 _a1 Vdd Vdd PMOS
M794 N116 -b1 Vdd Vdd PMOS
M795 N116 _a1 P228 P228 NMOS
M796 P228 -b1 0 0 NMOS
M797 N118 N116 Vdd Vdd PMOS
M798 N118 N106 Vdd Vdd PMOS
M799 N118 N106 P229 P229 NMOS
M800 P229 N116 0 0 NMOS
M801 N108 N118 Vdd Vdd PMOS
M802 N108 -c1 Vdd Vdd PMOS
M803 N108 -c1 P230 P230 NMOS
M804 P230 N118 0 0 NMOS
M805 N111 N108 0 0 NMOS
M806 N111 N108 Vdd Vdd PMOS
M807 N120 a1 Vdd Vdd PMOS
M808 N120 -b1 Vdd Vdd PMOS
M809 N120 a1 P231 P231 NMOS
M810 P231 -b1 0 0 NMOS
M811 N114 N120 0 0 NMOS
M812 N114 N120 Vdd Vdd PMOS
M813 P232 N111 Vdd Vdd PMOS
M814 N112 N114 0 0 NMOS
M815 N112 N111 0 0 NMOS
M816 N112 N114 P232 P232 PMOS
M817 -c2 N112 0 0 NMOS
M818 -c2 N112 Vdd Vdd PMOS
M819 N123 a2 Vdd Vdd PMOS
M820 N123 _-b2 Vdd Vdd PMOS
M821 N123 a2 P233 P233 NMOS
M822 P233 _-b2 0 0 NMOS
M823 N128 _a2 Vdd Vdd PMOS
M824 N128 -b2 Vdd Vdd PMOS
M825 N128 _a2 P234 P234 NMOS
M826 P234 -b2 0 0 NMOS
M827 _a2 a2 0 0 NMOS
M828 _a2 a2 Vdd Vdd PMOS
M829 -b2 _-b2 0 0 NMOS
M830 -b2 _-b2 Vdd Vdd PMOS
M831 -x2 N128 Vdd Vdd PMOS
M832 -x2 N123 Vdd Vdd PMOS
M833 -x2 N123 P235 P235 NMOS
M834 P235 N128 0 0 NMOS
M835 N124 -x2 Vdd Vdd PMOS
M836 N124 _-c2 Vdd Vdd PMOS
M837 N124 -x2 P236 P236 NMOS
M838 P236 _-c2 0 0 NMOS
M839 N130 _-x2 Vdd Vdd PMOS
M840 N130 -c2 Vdd Vdd PMOS
M841 N130 _-x2 P237 P237 NMOS
M842 P237 -c2 0 0 NMOS
M843 _-x2 -x2 0 0 NMOS
M844 _-x2 -x2 Vdd Vdd PMOS
M845 _-c2 -c2 0 0 NMOS
M846 _-c2 -c2 Vdd Vdd PMOS
M847 sub2 N130 Vdd Vdd PMOS
M848 sub2 N124 Vdd Vdd PMOS
M849 sub2 N124 P238 P238 NMOS
M850 P238 N130 0 0 NMOS
M851 N136 a2 Vdd Vdd PMOS
M852 N136 _-b2 Vdd Vdd PMOS
M853 N136 a2 P239 P239 NMOS
M854 P239 _-b2 0 0 NMOS
M855 N150 _a2 Vdd Vdd PMOS
M856 N150 -b2 Vdd Vdd PMOS
M857 N150 _a2 P240 P240 NMOS
M858 P240 -b2 0 0 NMOS
M859 N152 N150 Vdd Vdd PMOS
M860 N152 N136 Vdd Vdd PMOS
M861 N152 N136 P241 P241 NMOS
M862 P241 N150 0 0 NMOS
M863 N138 N152 Vdd Vdd PMOS
M864 N138 -c2 Vdd Vdd PMOS
M865 N138 -c2 P242 P242 NMOS
M866 P242 N152 0 0 NMOS
M867 N141 N138 0 0 NMOS
M868 N141 N138 Vdd Vdd PMOS
M869 N156 a2 Vdd Vdd PMOS
M870 N156 -b2 Vdd Vdd PMOS
M871 N156 a2 P243 P243 NMOS
M872 P243 -b2 0 0 NMOS
M873 N147 N156 0 0 NMOS
M874 N147 N156 Vdd Vdd PMOS
M875 P244 N141 Vdd Vdd PMOS
M876 N142 N147 0 0 NMOS
M877 N142 N141 0 0 NMOS
M878 N142 N147 P244 P244 PMOS
M879 -c3 N142 0 0 NMOS
M880 -c3 N142 Vdd Vdd PMOS
M881 N121 a3 Vdd Vdd PMOS
M882 N121 _-b3 Vdd Vdd PMOS
M883 N121 a3 P245 P245 NMOS
M884 P245 _-b3 0 0 NMOS
M885 N127 _a3 Vdd Vdd PMOS
M886 N127 -b3 Vdd Vdd PMOS
M887 N127 _a3 P246 P246 NMOS
M888 P246 -b3 0 0 NMOS
M889 _a3 a3 0 0 NMOS
M890 _a3 a3 Vdd Vdd PMOS
M891 -b3 _-b3 0 0 NMOS
M892 -b3 _-b3 Vdd Vdd PMOS
M893 -x3 N127 Vdd Vdd PMOS
M894 -x3 N121 Vdd Vdd PMOS
M895 -x3 N121 P247 P247 NMOS
M896 P247 N127 0 0 NMOS
M897 N122 -x3 Vdd Vdd PMOS
M898 N122 _-c3 Vdd Vdd PMOS
M899 N122 -x3 P248 P248 NMOS
M900 P248 _-c3 0 0 NMOS
M901 N129 _-x3 Vdd Vdd PMOS
M902 N129 -c3 Vdd Vdd PMOS
M903 N129 _-x3 P249 P249 NMOS
M904 P249 -c3 0 0 NMOS
M905 _-x3 -x3 0 0 NMOS
M906 _-x3 -x3 Vdd Vdd PMOS
M907 _-c3 -c3 0 0 NMOS
M908 _-c3 -c3 Vdd Vdd PMOS
M909 sub3 N129 Vdd Vdd PMOS
M910 sub3 N122 Vdd Vdd PMOS
M911 sub3 N122 P250 P250 NMOS
M912 P250 N129 0 0 NMOS
M913 N135 a3 Vdd Vdd PMOS
M914 N135 _-b3 Vdd Vdd PMOS
M915 N135 a3 P251 P251 NMOS
M916 P251 _-b3 0 0 NMOS
M917 N149 _a3 Vdd Vdd PMOS
M918 N149 -b3 Vdd Vdd PMOS
M919 N149 _a3 P252 P252 NMOS
M920 P252 -b3 0 0 NMOS
M921 N151 N149 Vdd Vdd PMOS
M922 N151 N135 Vdd Vdd PMOS
M923 N151 N135 P253 P253 NMOS
M924 P253 N149 0 0 NMOS
M925 N137 N151 Vdd Vdd PMOS
M926 N137 -c3 Vdd Vdd PMOS
M927 N137 -c3 P254 P254 NMOS
M928 P254 N151 0 0 NMOS
M929 N139 N137 0 0 NMOS
M930 N139 N137 Vdd Vdd PMOS
M931 N155 a3 Vdd Vdd PMOS
M932 N155 -b3 Vdd Vdd PMOS
M933 N155 a3 P255 P255 NMOS
M934 P255 -b3 0 0 NMOS
M935 N145 N155 0 0 NMOS
M936 N145 N155 Vdd Vdd PMOS
M937 P256 N139 Vdd Vdd PMOS
M938 N140 N145 0 0 NMOS
M939 N140 N139 0 0 NMOS
M940 N140 N145 P256 P256 PMOS
M941 -carry N140 0 0 NMOS
M942 -carry N140 Vdd Vdd PMOS
.model NMOS NMOS
.model PMOS PMOS
.lib standard.mos
* 0th Bit
* 2nd Bit
* 3rd Bit
* 1st Bit
* 000  :  Addition
* OP Code
* Operation
* 001  :  Subtraction
* 010  :  Bitwise AND
* 011  :  Bitwise OR
* 100  :  Bitwise NOT
* 101  :  Bitwise XOR
* 110  :  Increment
* 111  :  Left Shift
* Bitwise AND
* Bitwise OR
* Bitwise XOR
* Bitwise NOT
* Bitwise Left
* Shift
* 4 Bit Full Adder
.tran 16
* LSB
* MSB
* LSB
* MSB
* MSB
* LSB
* Input A
* Input B
* OUTPUT
* LSB
* MSB
* ~B
* Increment in A
* 4 Bit Full Subtractor
.backanno
.end